# EAGLE design DSUB_SCSI (EAGLE 9.6.2)
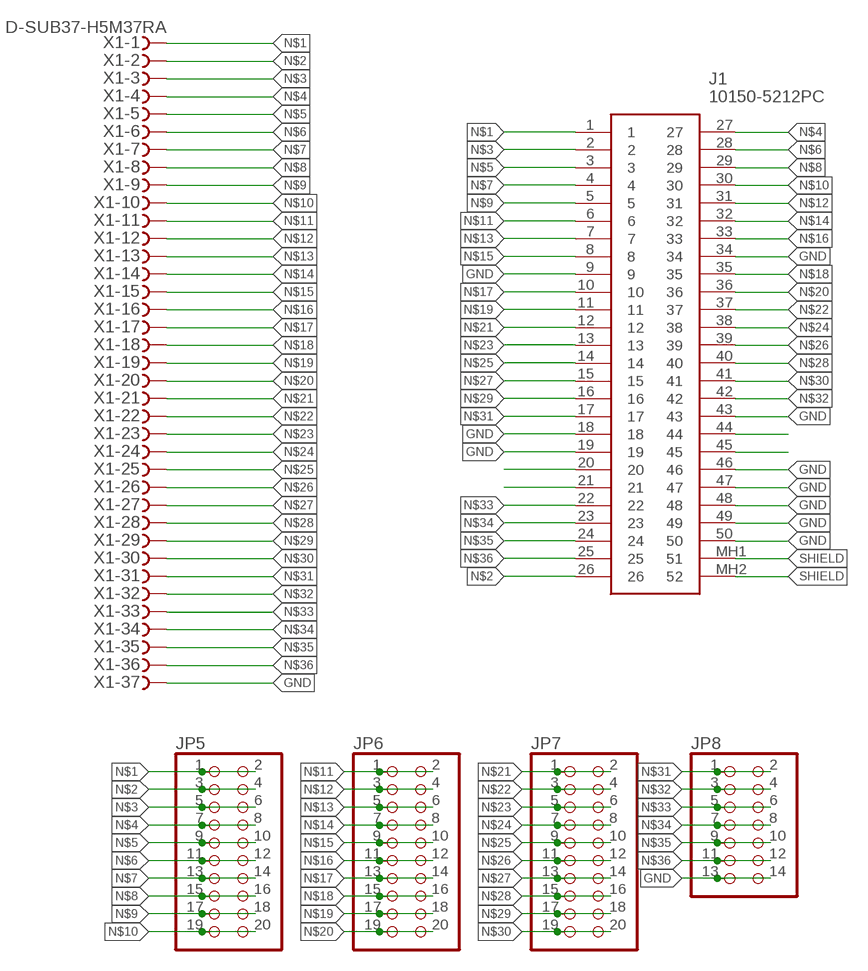
[diagram p0: schematic, sheet 1]

## Parts
J1  10150-5212PC  [101505212PC]
JP5  PINHD-2X10  [2X10]
JP6  PINHD-2X10  [2X10]
JP7  PINHD-2X10  [2X10]
JP8  PINHD-2X7  [2X07]
X1  D-SUB37-H5M37RA  [H5M37RA]

## Nets
GND: J1.9 J1.18 J1.19 J1.34 J1.43 J1.46 J1.47 J1.48 J1.49 J1.50 JP8.13 JP8.14 X1.37
N$1: J1.1 JP5.1 JP5.2 X1.1
N$2: J1.26 JP5.3 JP5.4 X1.2
N$3: J1.2 JP5.5 JP5.6 X1.3
N$4: J1.27 JP5.7 JP5.8 X1.4
N$5: J1.3 JP5.9 JP5.10 X1.5
N$6: J1.28 JP5.11 JP5.12 X1.6
N$7: J1.4 JP5.13 JP5.14 X1.7
N$8: J1.29 JP5.15 JP5.16 X1.8
N$9: J1.5 JP5.17 JP5.18 X1.9
N$10: J1.30 JP5.19 JP5.20 X1.10
N$11: J1.6 JP6.1 JP6.2 X1.11
N$12: J1.31 JP6.3 JP6.4 X1.12
N$13: J1.7 JP6.5 JP6.6 X1.13
N$14: J1.32 JP6.7 JP6.8 X1.14
N$15: J1.8 JP6.9 JP6.10 X1.15
N$16: J1.33 JP6.11 JP6.12 X1.16
N$17: J1.10 JP6.13 JP6.14 X1.17
N$18: J1.35 JP6.15 JP6.16 X1.18
N$19: J1.11 JP6.17 JP6.18 X1.19
N$20: J1.36 JP6.19 JP6.20 X1.20
N$21: J1.12 JP7.1 JP7.2 X1.21
N$22: J1.37 JP7.3 JP7.4 X1.22
N$23: J1.13 JP7.5 JP7.6 X1.23
N$24: J1.38 JP7.7 JP7.8 X1.24
N$25: J1.14 JP7.9 JP7.10 X1.25
N$26: J1.39 JP7.11 JP7.12 X1.26
N$27: J1.15 JP7.13 JP7.14 X1.27
N$28: J1.40 JP7.15 JP7.16 X1.28
N$29: J1.16 JP7.17 JP7.18 X1.29
N$30: J1.41 JP7.19 JP7.20 X1.30
N$31: J1.17 JP8.1 JP8.2 X1.31
N$32: J1.42 JP8.3 JP8.4 X1.32
N$33: J1.22 JP8.5 JP8.6 X1.33
N$34: J1.23 JP8.7 JP8.8 X1.34
N$35: J1.24 JP8.9 JP8.10 X1.35
N$36: J1.25 JP8.11 JP8.12 X1.36
N$57: J1.20
N$58: J1.21
N$81: J1.44
N$82: J1.45
SHIELD: J1.MH1 J1.MH2

## Library data of the parts
J1 = SamacSys_Parts:10150-5212PC: 50 Position Plug Connector Panel Mount, Through Hole, Right Angle Solder Source: Datasheet <http://multimedia.3m.com/mws/media/22353O/3mtm-mdr-050-bm-thru-hole-ra-plug-shielded-ts0620.pdf>; DESCRIPTION: 50 Position Plug Connector Panel Mount, Through Hole, Right Angle Solder; HEIGHT: 8.4mm; MANUFACTURER_NAME: 3M; MANUFACTURER_PART_NUMBER: 10150-5212PC; MOUSER_PART_NUMBER: 517-10150-5212PC; MOUSER_PRICE-STOCK: https://www.mouser.co.uk/ProductDetail/3M-Electronic-Solutions-Division/10150-5212PC?qs=vTdArO7BBRUONMTcNQ6TIQ%3D%3D
JP5-JP7 = pinhead:PINHD-2X10: PIN HEADER
JP8 = pinhead:PINHD-2X7: PIN HEADER
X1 = con-thomas-betts:D-SUB37-: D-Subminiatur Connector Source: Electronioc Interconnects European Edition 1998; MPN: H5M37RA29CS; OC_FARNELL: unknown; OC_NEWARK: 93F8325

## Board
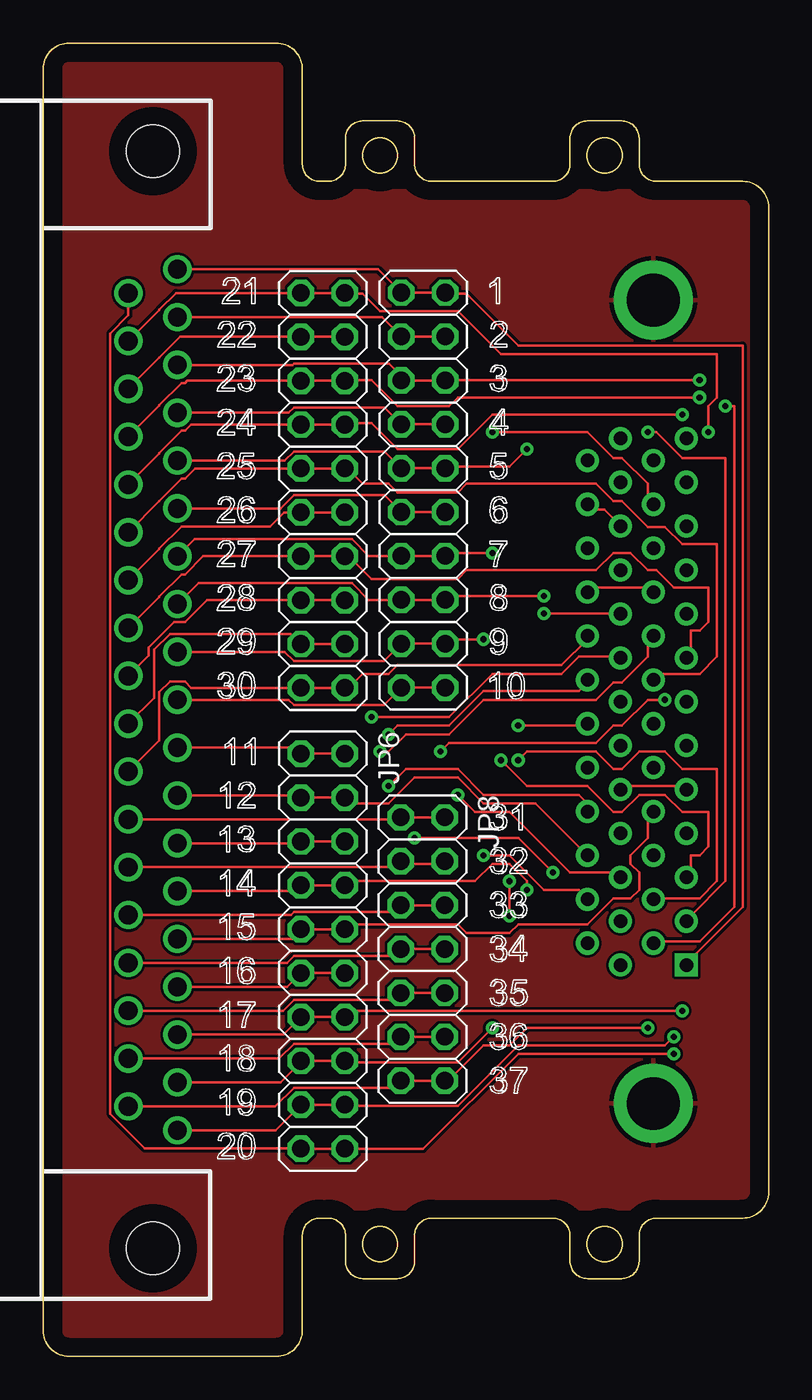
[diagram p1: board, top side]
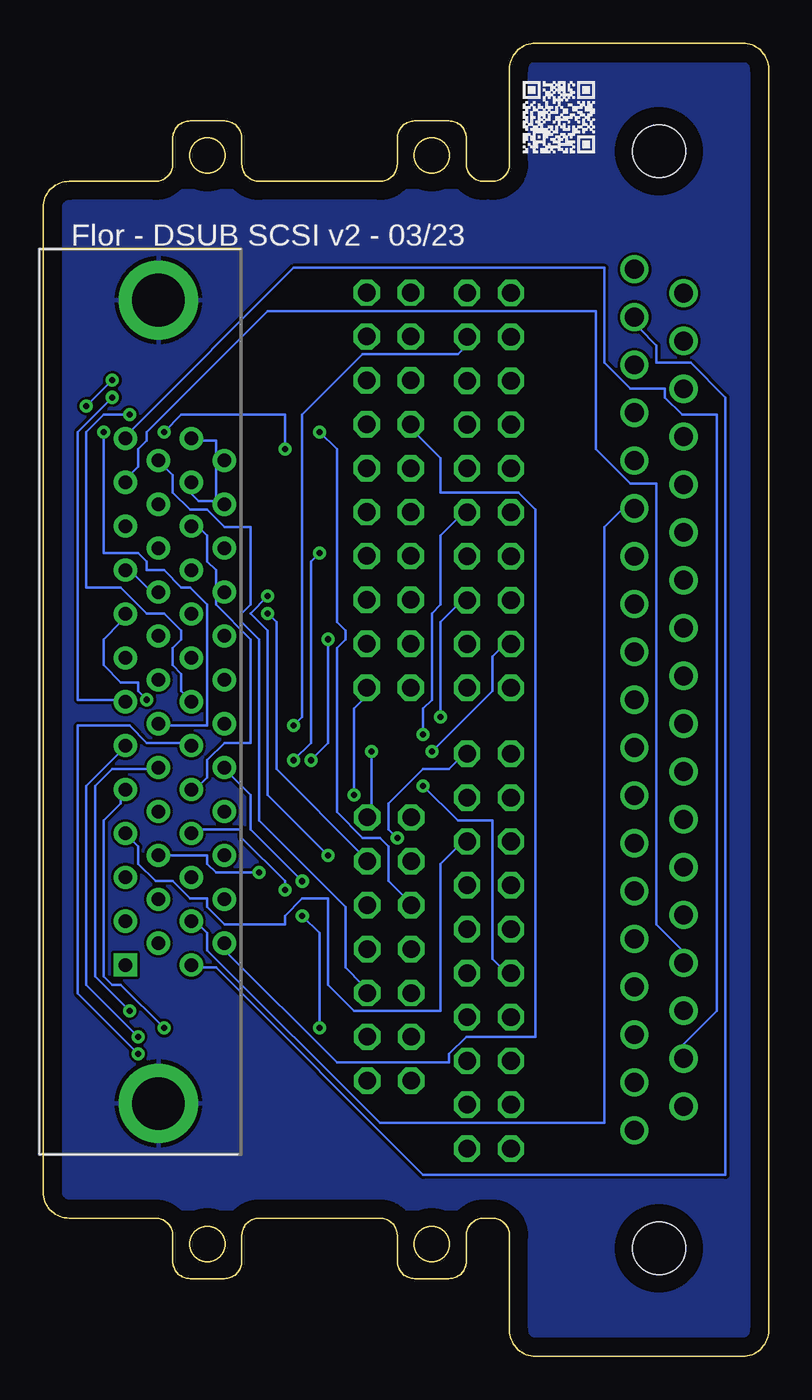
[diagram p2: board, bottom side, seen from below]

Size 42 x 76 mm. Coordinates in mm from the lower left corner, seen from the top.
Outline: 15,1.5 15,7 arc-90 16,8 16.5,8 arc-90 17.5,7 17.5,5.5 arc90 18.5,4.5 20.5,4.5 arc90 21.5,5.5 21.5,7 arc-90 22.5,8 29.5,8 arc-90 30.5,7 30.5,5.5 arc90 31.5,4.5 33.5,4.5 arc90 34.5,5.5 34.5,7 arc-90 35.5,8 40.5,8 arc90 42,9.5 42,66.5 arc90 40.5,68 35.5,68 arc-90 34.5,69 34.5,70.5 arc90 33.5,71.5 31.5,71.5 arc90 30.5,70.5 30.5,69 arc-90 29.5,68 22.5,68 arc-90 21.5,69 21.5,70.5 arc90 20.5,71.5 18.5,71.5 arc90 17.5,70.5 17.5,69 arc-90 16.5,68 16,68 arc-90 15,69 15,74.5 arc90 13.5,76 1.5,76 arc90 0,74.5 0,1.5 arc90 1.5,0 13.5,0 arc90 15,1.5
Outline: circle at 19.5,69.5 radius 1
Outline: circle at 32.5,69.5 radius 1
Outline: circle at 19.5,6.5 radius 1
Outline: circle at 32.5,6.5 radius 1
Copper layers (1*16): Top 0.035mm / dielectric 1.5mm / Bottom 0.035mm
Design rules "default": minimum track width 6mil, minimum drill 0.35mm, track to track 6mil, track to pad 6mil, pad to pad 6mil, via to via 6mil, smd to smd 6mil, copper to edge 40mil, drill to drill 6mil, minimum pad ring 10mil, minimum via ring 8mil, stop-mask expansion 4mil, vias tented up to drill 0mil, thermal gap 10mil

### Footprints (pad centres in the part's own frame; a part is rotated, then mirrored left to right if it is on the bottom)
101505212PC = drill 0.78 pad 1.337 square: 1 0,30.48 | drill 0.78 pad 1.337: 2 -1.91,29.21; 3 0,27.94; 4 -1.91,26.67; 5 0,25.4; 6 -1.91,24.13; 7 0,22.86; 8 -1.91,21.59; 9 0,20.32; 10 -1.91,19.05; 11 0,17.78; 12 -1.91,16.51; 13 0,15.24; 14 -1.91,13.97; 15 0,12.7; 16 -1.91,11.43; 17 0,10.16; 18 -1.91,8.89; 19 0,7.62; 20 -1.91,6.35; 21 0,5.08; 22 -1.91,3.81; 23 0,2.54; 24 -1.91,1.27; 25 0,0; 26 -3.82,30.48; 27 -5.73,29.21; 28 -3.82,27.94; 29 -5.73,26.67; 30 -3.82,25.4; 31 -5.73,24.13; 32 -3.82,22.86; 33 -5.73,21.59; 34 -3.82,20.32; 35 -5.73,19.05; 36 -3.82,17.78; 37 -5.73,16.51; 38 -3.82,15.24; 39 -5.73,13.97; 40 -3.82,12.7; 41 -5.73,11.43; 42 -3.82,10.16; 43 -5.73,8.89; 44 -3.82,7.62; 45 -5.73,6.35; 46 -3.82,5.08; 47 -5.73,3.81; 48 -3.82,2.54; 49 -5.73,1.27; 50 -3.82,0 | drill 3.05 pad 4.575: MH1 -1.91,38.49; MH2 -1.91,-8.01
2X10 = drill 1.016 octagon: 1 -11.43,-1.27; 2 -11.43,1.27; 3 -8.89,-1.27; 4 -8.89,1.27; 5 -6.35,-1.27; 6 -6.35,1.27; 7 -3.81,-1.27; 8 -3.81,1.27; 9 -1.27,-1.27; 10 -1.27,1.27; 11 1.27,-1.27; 12 1.27,1.27; 13 3.81,-1.27; 14 3.81,1.27; 15 6.35,-1.27; 16 6.35,1.27; 17 8.89,-1.27; 18 8.89,1.27; 19 11.43,-1.27; 20 11.43,1.27
2X07 = drill 1.016 octagon: 1 -7.62,-1.27; 2 -7.62,1.27; 3 -5.08,-1.27; 4 -5.08,1.27; 5 -2.54,-1.27; 6 -2.54,1.27; 7 0,-1.27; 8 0,1.27; 9 2.54,-1.27; 10 2.54,1.27; 11 5.08,-1.27; 12 5.08,1.27; 13 7.62,-1.27; 14 7.62,1.27
H5M37RA = drill 1.092: 1 -24.917,1.422; 2 -22.149,1.422; 3 -19.38,1.422; 4 -16.612,1.422; 5 -13.843,1.422; 6 -11.074,1.422; 7 -8.306,1.422; 8 -5.537,1.422; 9 -2.769,1.422; 10 0,1.422; 11 2.769,1.422; 12 5.537,1.422; 13 8.306,1.422; 14 11.074,1.422; 15 13.843,1.422; 16 16.612,1.422; 17 19.38,1.422; 18 22.149,1.422; 19 24.917,1.422; 20 -23.533,-1.422; 21 -20.765,-1.422; 22 -17.996,-1.422; 23 -15.227,-1.422; 24 -12.459,-1.422; 25 -9.69,-1.422; 26 -6.921,-1.422; 27 -4.153,-1.422; 28 -1.384,-1.422; 29 1.384,-1.422; 30 4.153,-1.422; 31 6.921,-1.422; 32 9.69,-1.422; 33 12.459,-1.422; 34 15.227,-1.422; 35 17.996,-1.422; 36 20.765,-1.422; 37 23.533,-1.422 | hole 3.048: -31.75,0; 31.75,0

### Placement (x,y rotation side)
J1  37.24,53.12 180 bottom
JP5  22,50.13 270 top
JP6  16.19,23.45 270 top
JP7  16.19,50.12 270 top
JP8  21.97,23.57 270 top
X1  6.35,38 270 top

### Tracks (layer width: path | path; a pad name or v marks a point on that pad's centre or on a via)
GND  (via drill 0.35)
  Top 0.152: JP8.13 20.75,15.95 | 20.75,15.95 JP8.14 23.5,16 25.5,18 27,18 28,19 v35,19 | X1.37 13.43,14.47 14.51,15.55 20.35,15.55 20.75,15.95 | J1.46 33,48.5 32.5,49 32,49 J1.47 | J1.34 33.5,33 37,33 J1.9 | J1.43 32,44.5 35,44.5 J1.18
  Bottom 0.152: 32,49.5 33,49.5 33.5,50 33.5,50.5 J1.48 | 32,49.5 32,51.5 J1.49 32,52 32,53 33,53 J1.50 | 32,49.5 J1.47 | J1.19 37,45.5 35.5,44 J1.18 | J1.34 33,33 32.5,33.5 32.5,34.5 31.5,35.5 30,35.5 30,41.5 32,43.5 32,44 J1.43 32,44.5 32,45.5 32.5,46 32.5,47.5 33,48 J1.46 | v35,19 37.5,21.5 38,21.5 38.5,22 38.5,31 37.5,32 37.5,32.5 J1.9
N$1
  Top 0.152: X1.1 19.37,62.92 JP5.1 JP5.2 23.5,61.5 24.5,61.5 27.5,58.5 40.5,58.5 40.5,26 37.5,23 J1.1
N$2
  Top 0.152: JP5.3 20.75,59.02 | 20.75,59.02 JP5.4 | X1.2 19.62,60.15 20.75,59.02
  Bottom 0.152: J1.26 33,22.5 32,22.5 20,10.5 2.5,10.5 2.5,55.5 4.5,57.5 6.5,57.5 6.5,58.5 7.5,59.5 7.5,60 X1.2
N$3  (via drill 0.35)
  Top 0.152: JP5.5 21,56.48 | 21,56.48 JP5.6 23.5,56.5 v38,56.5 | X1.3 14.44,57.38 14.51,57.46 20.02,57.46 21,56.48 | v39.5,55 40,55 40,26 38,24 35.5,24 J1.2
  Bottom 0.152: v38,56.5 v39.5,55
N$4
  Top 0.152: JP5.7 20.75,53.94 | 20.75,53.94 JP5.8 | X1.4 14.21,54.61 14.51,54.92 19.77,54.92 20.75,53.94
  Bottom 0.152: J1.27 31.5,23.5 25,17 18.5,17 18.5,17.5 17.5,18.5 13.5,18.5 13.5,49 14.5,50 19,50 19,52 20.5,53.5 JP5.7
N$5  (via drill 0.35)
  Top 0.152: JP5.9 20.75,51.4 | 20.75,51.4 JP5.10 23.5,51.5 27,51.5 v28,52.5 | X1.5 13.98,51.84 14.51,52.38 19.77,52.38 20.75,51.4 | v35,53.5 35.5,53.5 37,52 39.5,52 39.5,27.5 37.5,25.5 J1.3
  Bottom 0.152: v35,53.5 34,54.5 28,54.5 v28,52.5
N$6
  Top 0.152: JP5.11 20.75,48.86 | 20.75,48.86 JP5.12 | X1.6 13.75,49.07 14.51,49.84 19.77,49.84 20.75,48.86
  Bottom 0.152: J1.28 33,25 32.5,24.5 32.5,23.5 22.5,13.5 9.5,13.5 9.5,48 8,49.5 X1.6
N$7  (via drill 0.35)
  Top 0.152: X1.7 8.76,47.3 17.87,47.3 18.85,46.32 JP5.13 JP5.14 23.5,46.5 v26,46.5 | v27.5,34.5 28,35 32,35 33,34 33.5,34 34.5,35 36,35 37,34 39,34 39,27.5 38,26.5 35.5,26.5 J1.4
  Bottom 0.152: v27.5,34.5 26.5,35.5 26.5,46 v26,46.5
N$8  (via drill 0.35)
  Top 0.152: X1.8 8.99,44.76 17.87,44.76 18.85,43.78 JP5.15 JP5.16 23.5,44 v29,44 | v25.5,29 27,29 29,27 31,27 31.5,26.5 J1.29
  Bottom 0.152: v25.5,29 29,32.5 29,42 30,43 v29,44
N$9  (via drill 0.35)
  Top 0.152: JP5.17 20.75,41.24 | 20.75,41.24 JP5.18 23.5,41.5 v25.5,41.5 | X1.9 13.98,40.77 14.51,40.23 19.74,40.23 20.75,41.24 | v26.5,34.5 28,33 31.5,33 33,31.5 33.5,31.5 34.5,32.5 36,32.5 37,31.5 38.5,31.5 38.5,29.5 38,29 37.5,29 37.5,28 J1.5
  Bottom 0.152: v26.5,34.5 25.5,35.5 v25.5,41.5
N$10  (via drill 0.35)
  Top 0.152: JP5.20 JP5.19 19.72,37.7 14.51,37.7 14.21,38 X1.10 | v24,32.5 25,31.5 27,31.5 30.5,28 33,28 J1.30
  Bottom 0.152: v24,32.5 24,37.5 23.5,38 23.5,38.5 JP5.20
N$11  (via drill 0.35)
  Top 0.152: JP6.1 15,34.88 | 15,34.88 JP6.2 | X1.11 14.65,35.23 15,34.88 | v29.5,28 27.5,30 v21.5,30
  Bottom 0.152: v29.5,28 32,28 32.5,28.5 32.5,29 35,29 J1.6 | v21.5,30 22,30.5 22,32 20,34 18.5,34 17.5,35 JP6.2
N$12
  Top 0.152: JP6.3 15.25,32.34 | 15.25,32.34 JP6.4 17.5,32 20,32 21.5,33.5 24,33.5 25.5,32 28.5,32 J1.31 | X1.12 15.13,32.46 15.25,32.34
N$13
  Top 0.152: JP6.5 15,29.8 | 15,29.8 JP6.6 | X1.13 14.89,29.69 15,29.8
  Bottom 0.152: J1.7 37,30 36.5,29.5 36.5,28.5 35.5,27.5 34.5,27.5 33.5,26.5 32.5,26.5 32.5,26 31.5,25 28,25 28,25.5 27,26.5 25.5,26.5 25.5,21.5 24,20 19,20 19,28.5 17.5,30 JP6.6
N$14  (via drill 0.35)
  Top 0.152: X1.14 14.59,26.93 JP6.7 JP6.8 17.5,27.5 25,27.5 26,28.5 27,28.5 28,27.5 v28,27
  Bottom 0.152: v28,27 28,27.5 30.5,30 30.5,30.5 33,30.5 J1.32
N$15
  Top 0.152: JP6.9 15,24.72 | 15,24.72 JP6.10 17.5,25 24,25 24.5,24.5 27,24.5 27.5,25 31.5,25 33,26.5 34,26.5 34.5,27 34.5,28 34,28.5 34,29 35,30 35,31.5 J1.8 | X1.15 14.44,24.16 15,24.72
N$16  (via drill 0.35)
  Top 0.152: JP6.12 JP6.11 14.13,21.39 X1.16 | v20,33 21,34 24,34 25.5,32.5 31,32.5 31.5,32 J1.33
  Bottom 0.152: v20,33 18,31 16,31 16,23 15,22 JP6.11
N$17  (via drill 0.35)
  Top 0.152: X1.17 13.9,18.62 JP6.13 JP6.14 17.5,20 v37,20
  Bottom 0.152: v37,20 39,22 39,33 38,34 35.5,34 J1.10
N$18  (via drill 0.35)
  Top 0.152: JP6.15 15,17.1 | 15,17.1 JP6.16 17.5,17 24,17 v26,19 | X1.18 13.75,15.85 15,17.1 | v27,25.5 v27,27.5
  Bottom 0.152: v27,27.5 30,30.5 30,32.5 31.5,34 J1.35 | v27,25.5 26,24.5 v26,19
N$19  (via drill 0.35)
  Top 0.152: X1.19 13.45,13.08 JP6.17 JP6.18 17.5,14.5 24,14.5 27.5,18 36,18 v36.5,18.5
  Bottom 0.152: v36.5,18.5 39.5,21.5 39.5,33 37.5,35 J1.11
N$20  (via drill 0.35)
  Top 0.152: JP6.19 15.25,12.02 | 15.25,12.02 JP6.20 17.5,12 22,12 27.5,17.5 v36.5,17.5 | X1.20 4.93,60.25 3.88,59.2 3.88,14.03 5.88,12.04 15.23,12.04 15.25,12.02
  Bottom 0.152: v36.5,17.5 40,21 40,36.5 37,36.5 36,35.5 33.5,35.5 J1.36
N$21  (via drill 0.35)
  Top 0.152: X1.21 6.72,60.56 6.72,60.58 7.69,61.55 JP7.1 JP7.2 17.5,61.5 18.5,61.5 19.5,60.5 24,60.5 26.5,58 39,58 39,55.5 38.5,55 v38.5,53.5
  Bottom 0.152: v38.5,53.5 38.5,46.5 36.5,46.5 36,46 36,45.5 35,45.5 34,44.5 33.5,44.5 32.5,43.5 32.5,36.5 35,36.5 J1.12
N$22  (via drill 0.35)
  Top 0.152: JP7.4 JP7.3 7.92,59.01 6.72,57.81 6.72,57.79 X1.22 | v27.5,36.5 31.5,36.5 J1.37
  Bottom 0.152: v27.5,36.5 27,37 27,54.5 23.5,58 18,58 17.5,58.5 17.5,59 JP7.4
N$23  (via drill 0.35)
  Top 0.152: X1.23 6.72,55.02 6.72,55.05 8.01,56.33 8.21,56.33 8.34,56.47 JP7.5 JP7.6 17.5,56.5 19,56.5 20.5,55 23.5,55 24,55.5 v38,55.5
  Bottom 0.152: v38,55.5 40,53.5 40,38 37.5,38 J1.13
N$24  (via drill 0.35)
  Top 0.152: X1.24 6.72,52.26 6.72,52.28 8.01,53.56 8.21,53.56 8.57,53.93 JP7.7 JP7.8 17.5,54 19,54 20.5,52.5 24,52.5 26,54.5 v37,54.5
  Bottom 0.152: v37,54.5 38.5,54.5 39.5,53.5 39.5,44.5 37.5,44.5 36,43 35,43 34,42 34,41.5 34.5,41 34.5,40 34,39.5 34,38.5 33.5,38 J1.38
N$25
  Top 0.152: X1.25 6.72,49.49 6.72,49.51 8.01,50.8 8.21,50.8 8.8,51.39 JP7.9 JP7.10 17.5,51 18,51 18.5,50.5 20,50.5 20.5,50 24,50 24.5,50.5 32,50.5 33,49.5 33.5,49.5 35,48 36,48 37,47 39,47 39,40.5 38,39.5 35.5,39.5 J1.14
N$26  (via drill 0.35)
  Top 0.152: JP7.12 JP7.11 13.95,48.85 13.13,48.03 8.01,48.03 6.72,46.74 6.72,46.72 X1.26 | v20,36 20.5,36.5 23.5,36.5 25.5,38.5 31,38.5 31.5,39 J1.39
  Bottom 0.152: v20,36 20,37.5 19.5,38 19.5,43 19,43.5 19,47.5 17.5,49 JP7.12
N$27
  Top 0.152: X1.27 6.72,43.95 6.72,43.97 8.01,45.26 8.21,45.26 9.25,46.31 JP7.13 JP7.14 17.5,46 18,46 19,45 24,45 24.5,45.5 32,45.5 33,46.5 34,46.5 35,45.5 35.5,45.5 36.5,44.5 38.5,44.5 38.5,42.5 38,42 37.5,42 37.5,40.5 J1.15
N$28  (via drill 0.35)
  Top 0.152: JP7.16 JP7.15 9.48,43.77 8.21,42.49 7.58,42.49 6.12,41.02 6.12,40.57 X1.28 | v19,37 23.5,37 26,39.5 30,39.5 31,40.5 33,40.5 J1.40
  Bottom 0.152: v19,37 19,42.5 17.5,44 JP7.16
N$29  (via drill 0.35)
  Top 0.152: JP7.18 JP7.17 14.33,41.82 7.34,41.82 6.42,40.9 6.42,38.11 X1.29 | v19.5,35 20,35 21,36 23.5,36 25.5,38 32,38 33,39 33.5,39 35,40.5 35,41.5 J1.16
  Bottom 0.152: v19.5,35 16,38.5 16,40.5 15,41.5 JP7.17
N$30
  Top 0.152: X1.30 6.72,35.64 6.72,38.43 7.34,39.05 8.21,39.05 8.57,38.69 JP7.19 JP7.20 17.5,39 18,39 18.5,39.5 20,39.5 20.5,40 30,40 31.5,41.5 J1.41
N$31  (via drill 0.35)
  Top 0.152: JP8.1 20.75,31.19 | 20.75,31.19 JP8.2 | X1.31 20.64,31.08 20.75,31.19 | v36,38 35,38 33.5,36.5 33,36.5 32,35.5 23.5,35.5 v23,35
  Bottom 0.152: v36,38 36.5,38.5 36.5,39 37.5,39 38.5,40 38.5,41.5 37.5,42.5 J1.17 | v23,35 23,31.5 JP8.2
N$32  (via drill 0.35)
  Top 0.152: X1.32 20.36,28.31 JP8.3 21,28.5 23,28.5 JP8.4 | v29,43 33,43 J1.42
  Bottom 0.152: v29,43 28.5,42.5 28.5,34 23.5,29 JP8.4
N$33  (via drill 0.35)
  Top 0.152: JP8.6 JP8.5 20.3,25.71 14.51,25.71 14.34,25.54 X1.33 | v26,53.5 31.5,53.5 33,52 33.5,52 35,50.5 35,49.5 J1.22
  Bottom 0.152: v26,53.5 25,52.5 25,42.5 24.5,42 24.5,41.5 25,41 25,31.5 23.5,30 22.5,30 22,29.5 22,27.5 21,26.5 JP8.5
N$34
  Top 0.152: JP8.7 20.75,23.57 | 20.75,23.57 JP8.8 | X1.34 14.12,22.77 14.51,23.17 20.35,23.17 20.75,23.57
  Bottom 0.152: J1.23 37,51 36.5,51.5 36.5,52.5 36,53 36,53.5 29,60.5 10,60.5 10,52.5 8,50.5 6.5,50.5 6.5,25 5,23.5 5,23 X1.34
N$35
  Top 0.152: JP8.10 JP8.9 20.3,20.63 14.51,20.63 13.89,20 X1.35
  Bottom 0.152: J1.24 35,51.5 34.5,51 34.5,50 33.5,49 32.5,49 31.5,48 30,48 30,43.5 30.5,43 30.5,42.5 29.5,41.5 29.5,31 24.5,26 24.5,22.5 23.5,21.5 JP8.10
N$36
  Top 0.152: JP8.11 20.75,18.49 | 20.75,18.49 JP8.12 | X1.36 13.66,17.23 14.51,18.09 20.35,18.09 20.75,18.49
  Bottom 0.152: J1.25 37,53.5 27.5,63 9.5,63 9.5,57.5 8,56 6,56 6,55.5 5,54.5 3,54.5 3,20 5,18 5,17.5 X1.36
SHIELD
  pour Top: 0.5,74.5 0.5,1.5 arc90 1.5,0.5 13.5,0.5 arc90 14.5,1.5 14.5,7.5 arc-90 15.5,8.5 40.5,8.5 arc90 41.5,9.5 41.5,66.5 arc90 40.5,67.5 15.5,67.5 arc-90 14.5,68.5 14.5,74.5 arc90 13.5,75.5 1.5,75.5 arc90
  pour Bottom: 13.5,0.5 1.5,0.5 arc-90 0.5,1.5 0.5,74.5 arc-90 1.5,75.5 13.5,75.5 arc-90 14.5,74.5 14.5,68.5 arc90 15.5,67.5 40.5,67.5 arc-90 41.5,66.5 41.5,9.5 arc-90 40.5,8.5 15.5,8.5 arc90 14.5,7.5 14.5,1.5 arc-90

### Text on the board
bNames: Flor - DSUB SCSI v2 - 03/23
tValues: C:/Users/f_mau/Desktop/qr_dsub_2.bmp